# EAGLE design SSM4 (EAGLE 9.2.2)
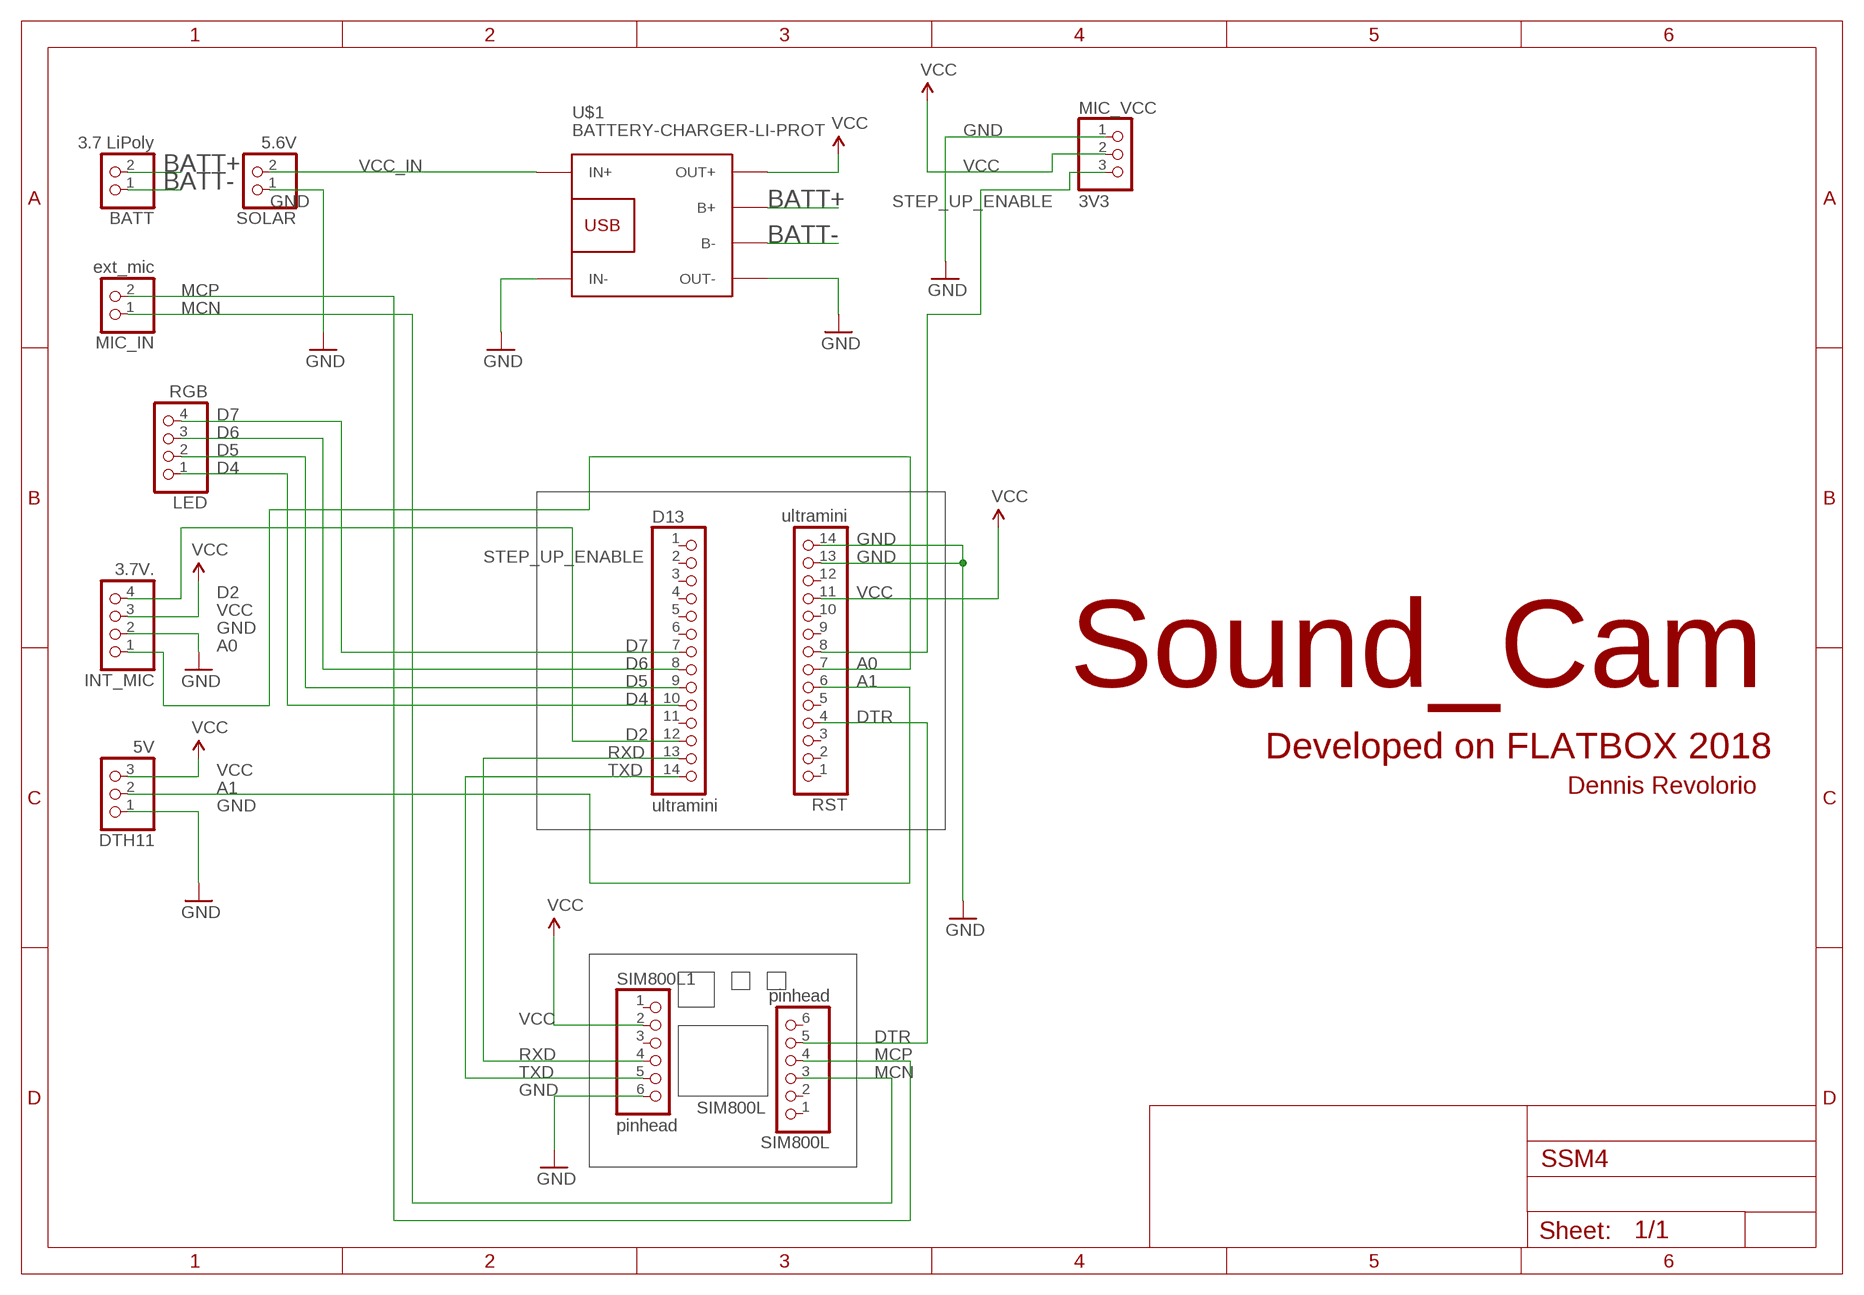
[diagram p0: schematic, sheet 1]

## Parts
BATT  3.7 LiPoly  PINHD-1X2  [1X02]
D13  ultramini  PINHD-1X14  [1X14]
DTH11  5V  PINHD-1X3  [1X03]
INT_MIC  3.7V.  PINHD-1X4  [1X04]
LED  RGB  PINHD-1X4  [1X04]
MIC_IN  ext_mic  PINHD-1X2  [1X02]
MIC_VCC  3V3  PINHD-1X3  [1X03]
RST  ultramini  PINHD-1X14  [1X14]
SIM800L  pinhead  PINHD-1X6  [1X06]
SIM800L1  pinhead  PINHD-1X6  [1X06]
SOLAR  5.6V  PINHD-1X2  [1X02]
U$1  BATTERY-CHARGER-LI-PROT  [BATTERY-CHARGER-LI-PROT]

## Nets
A0: INT_MIC.1 RST.7
A1: DTH11.2 RST.6
BATT+: BATT.2 U$1.B+
BATT-: BATT.1 U$1.B-
D2: D13.12 INT_MIC.4
D4: D13.10 LED.1
D5: D13.9 LED.2
D6: D13.8 LED.3
D7: D13.7 LED.4
DTR: RST.4 SIM800L.5
GND: DTH11.1 INT_MIC.2 MIC_VCC.1 RST.13 RST.14 SIM800L1.6 SOLAR.1 U$1.IN- U$1.OUT-
MCN: MIC_IN.1 SIM800L.3
MCP: MIC_IN.2 SIM800L.4
RXD: D13.13 SIM800L1.4
STEP_UP_ENABLE: MIC_VCC.3 RST.8
TXD: D13.14 SIM800L1.5
VCC: DTH11.3 INT_MIC.3 MIC_VCC.2 RST.11 SIM800L1.2 U$1.OUT+
VCC_IN: SOLAR.2 U$1.IN+
Unconnected: D13.1 D13.2 D13.3 D13.4 D13.5 D13.6 D13.11 RST.1 RST.2 RST.3 RST.5 RST.9 RST.10 RST.12 SIM800L1.1 SIM800L1.3 SIM800L.1 SIM800L.2 SIM800L.6

## Notes on the sheet
- Sound_Cam
- Developed on FLATBOX 2018
- Dennis Revolorio
- SIM800L

## Library data of the parts
BATT MIC_IN SOLAR = pinhead:PINHD-1X2: PIN HEADER
D13 RST = pinhead:PINHD-1X14: PIN HEADER
DTH11 MIC_VCC = pinhead:PINHD-1X3: PIN HEADER
INT_MIC LED = pinhead:PINHD-1X4: PIN HEADER
SIM800L SIM800L1 = pinhead:PINHD-1X6: PIN HEADER
U$1 = diy-modules:BATTERY-CHARGER-LI-PROT: Lithium Battery 5V Charger with protection circuit More details available here: http://www.instructables.com/id/DIY-Lithium-ion-Battery-Charger/step4/TP4056-based-lithium-ion-battery-charger-module/ Click here to find device on ebay.com <http://www.ebay.com/sch/tp4056+charger+usb+protection>

## Board
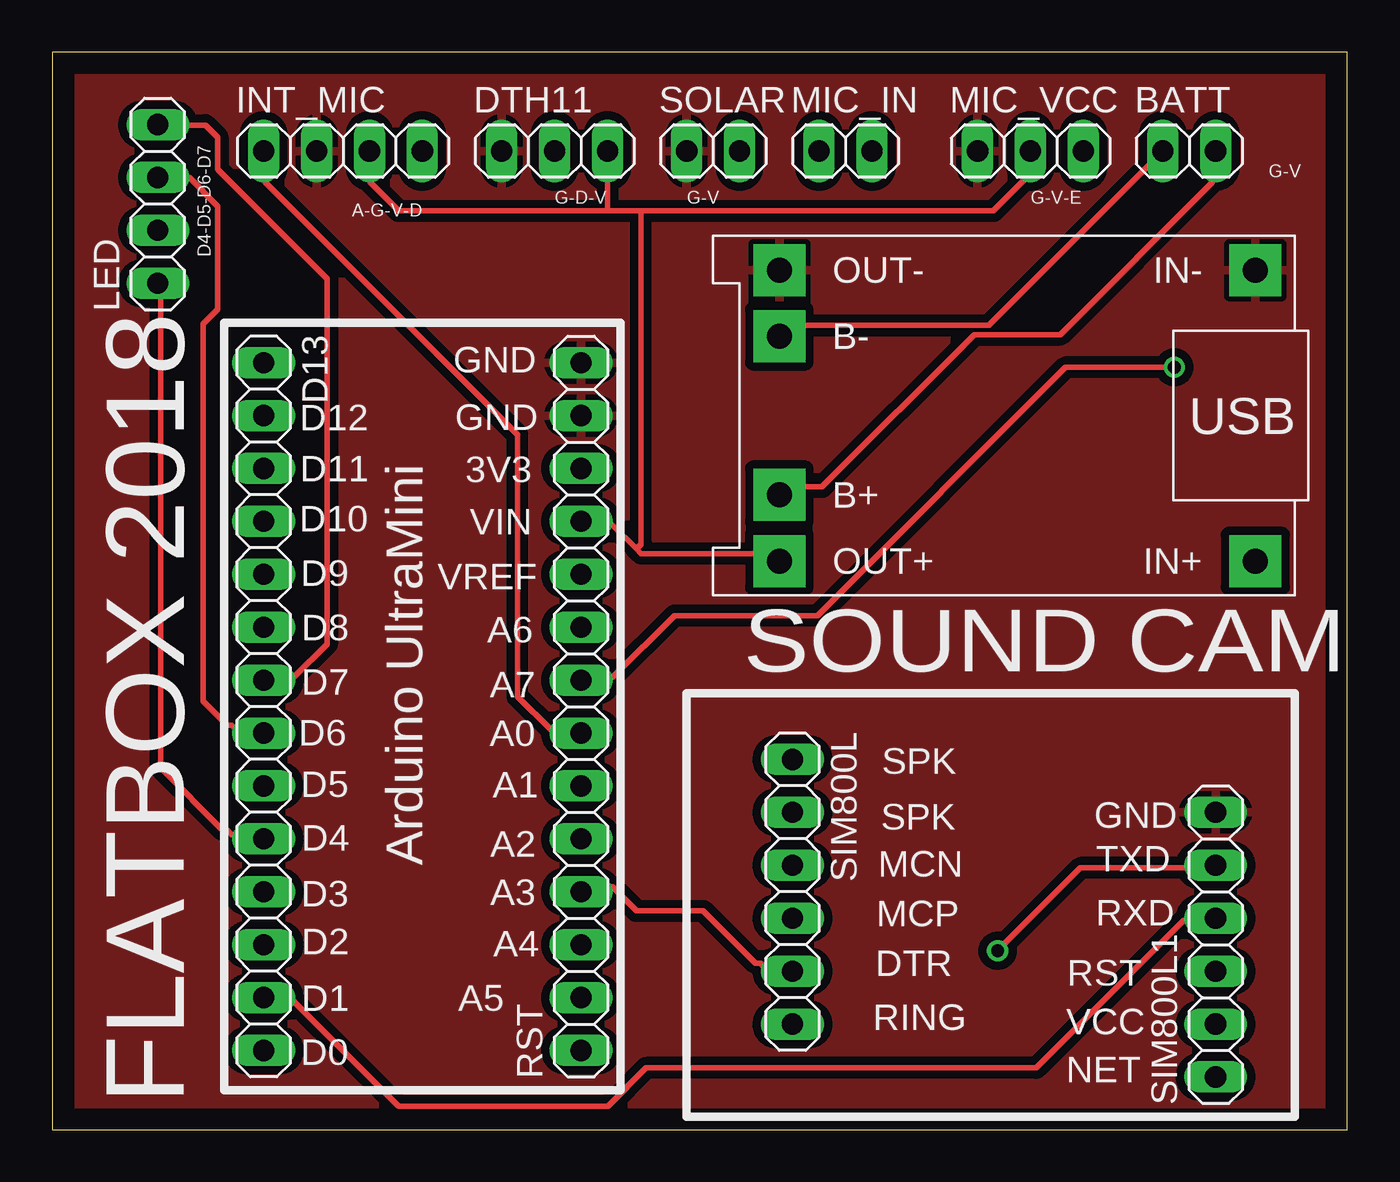
[diagram p1: board, top side]
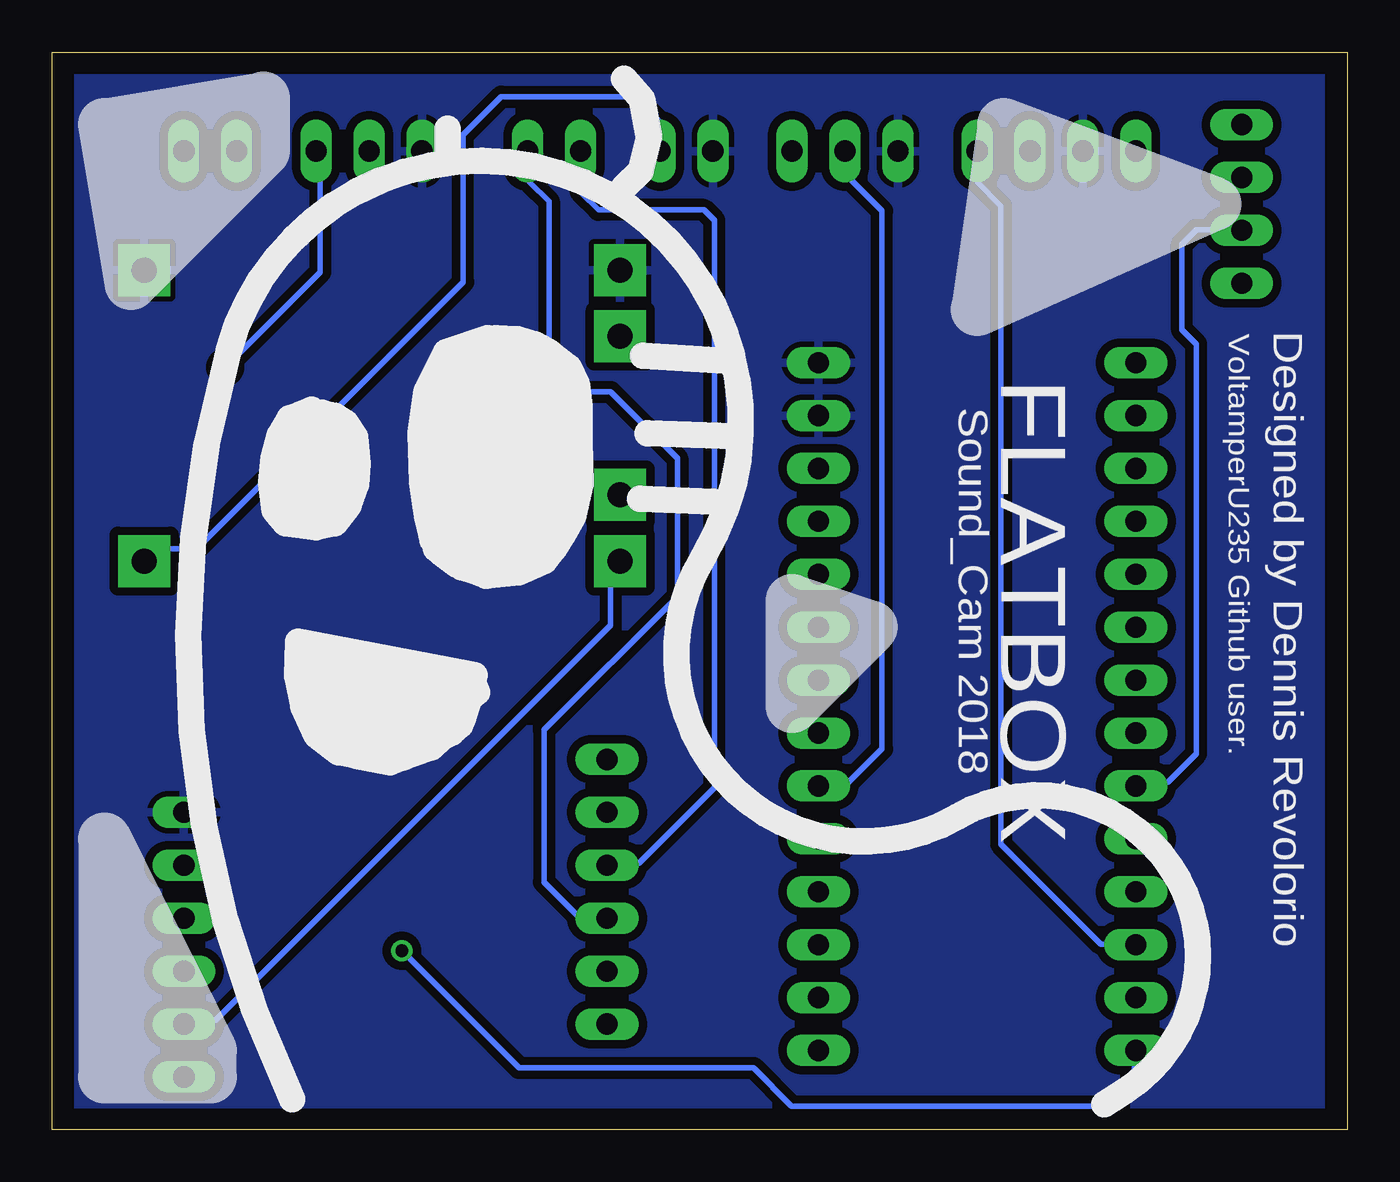
[diagram p2: board, bottom side, seen from below]

Size 62.21 x 51.74 mm. Coordinates in mm from the lower left corner, seen from the top.
Outline: 0,0 62.21,0 62.21,51.74 0,51.74 0,0
Copper layers (1*16): Top 0.035mm / dielectric 1.5mm / Bottom 0.035mm
Design rules "default": minimum track width 10mil, minimum drill 24mil, track to track 8mil, track to pad 8mil, pad to pad 8mil, via to via 8mil, smd to smd 8mil, copper to edge 40mil, drill to drill 8mil, minimum pad ring 10mil, minimum via ring 8mil, stop-mask expansion 4mil, vias tented up to drill 0mil, thermal gap 10mil

### Footprints (pad centres in the part's own frame; a part is rotated, then mirrored left to right if it is on the bottom)
1X02 = drill 1.016 long: 1 -1.27,0; 2 1.27,0
1X14 = drill 1.016 long: 1 -16.51,0; 2 -13.97,0; 3 -11.43,0; 4 -8.89,0; 5 -6.35,0; 6 -3.81,0; 7 -1.27,0; 8 1.27,0; 9 3.81,0; 10 6.35,0; 11 8.89,0; 12 11.43,0; 13 13.97,0; 14 16.51,0
1X03 = drill 1.016 long: 1 -2.54,0; 2 0,0; 3 2.54,0
1X04 = drill 1.016 long: 1 -3.81,0; 2 -1.27,0; 3 1.27,0; 4 3.81,0
1X06 = drill 1.016 long: 1 -6.35,0; 2 -3.81,0; 3 -1.27,0; 4 1.27,0; 5 3.81,0; 6 6.35,0
BATTERY-CHARGER-LI-PROT = drill 1.2 pad 2.5 square: B+ 10.795,3.81; B- 10.795,-3.81; IN+ -12.065,6.985; IN- -12.065,-6.985; OUT+ 10.795,6.985; OUT- 10.795,-6.985

### Placement (x,y rotation side)
BATT  54.61,46.99 0 top
D13  10.16,20.32 270 top
DTH11  24.13,46.99 0 top
INT_MIC  13.97,46.99 0 top
LED  5.08,44.45 90 top
MIC_IN  38.1,46.99 0 top
MIC_VCC  46.99,46.99 0 top
RST  25.4,20.32 90 top
SIM800L  35.56,11.43 270 top
SIM800L1  55.88,8.89 90 top
SOLAR  31.75,46.99 0 top
U$1  45.72,34.29 180 top

### Tracks (layer width: path | path; a pad name or v marks a point on that pad's centre or on a via)
A0
  Top 0.254: INT_MIC.1 10.24,46.86 10.24,45.49 22.35,33.38 22.35,20.8 23.95,19.2 25.32,19.2 RST.7
A1
  Bottom 0.254: DTH11.2 23.95,46.86 23.95,45.72 22.35,44.12 22.35,18.29 23.95,16.69 25.32,16.69 RST.6
BATT+
  Top 0.254: BATT.2 55.73,46.86 55.73,45.49 48.41,38.18 44.3,38.18 36.98,30.86 35.15,30.86 34.92,30.63 U$1.B+
BATT-
  Top 0.254: BATT.1 44.98,38.63 35.38,38.63 34.92,38.18 U$1.B-
D2
  Bottom 0.254: INT_MIC.4 17.78,45.49 16.64,44.35 16.64,13.72 11.84,8.91 10.24,8.91 D13.12
D4
  Top 0.254: LED.1 5.21,40.46 5.21,17.37 8.18,14.4 8.41,14.4 8.64,14.17 10.01,14.17 D13.10
D5
  Bottom 0.254: LED.2 5.21,43.2 7.26,43.2 7.95,42.52 7.95,38.41 7.26,37.72 7.26,18.06 8.64,16.69 10.01,16.69 D13.9
D6
  Top 0.254: LED.3 6.58,45.72 7.95,44.35 7.95,39.39 7.26,38.7 7.26,20.57 8.41,19.43 8.64,19.43 8.86,19.2 10.01,19.2 D13.8
D7
  Top 0.254: D13.7 10.24,21.72 11.61,21.72 13.21,23.32 13.21,40.85 7.95,46.11 7.95,47.65 7.37,48.23 5.21,48.23 LED.4
DTR
  Top 0.254: SIM800L.5 35.38,7.77 34.24,7.77 34.01,8 33.78,8 31.27,10.52 28.07,10.52 26.92,11.66 25.78,11.66 25.55,11.43 RST.4
GND
  pour Bottom (isolate 0.406): 1.27,50.8 60.96,50.8 60.96,0 1.27,0
  pour Top (isolate 0.406): 1.27,50.8 60.96,50.8 60.96,0 1.27,0
MCN
  Bottom 0.254: SIM800L.3 35.38,12.8 34.01,12.8 30.4,16.41 30.4,43.66 30.9,44.17 35.97,44.17 36.83,45.02 MIC_IN.1
MCP
  Bottom 0.254: SIM800L.4 35.61,10.29 36.98,10.29 38.58,11.89 38.58,19.2 32.18,25.6 32.18,32.23 35.38,35.43 36.75,35.43 38.35,37.03 38.35,44.58 39.27,45.49 39.27,46.86 MIC_IN.2
RXD
  Top 0.254: D13.13 10.24,6.17 11.61,6.17 16.64,1.14 26.69,1.14 28.52,2.97 47.27,2.97 54.36,10.06 55.73,10.06 SIM800L1.4
STEP_UP_ENABLE  (via drill 0.61)
  Top 0.254: v53.89,36.61 48.67,36.61 36.75,24.69 29.9,24.69 26.92,21.72 25.55,21.72 RST.8
  Bottom 0.254: v53.89,36.61 49.33,41.17 49.33,46.86 MIC_VCC.3
TXD  (via drill 0.61)
  Top 0.254: v45.41,8.59 49.39,12.57 55.73,12.57 SIM800L1.5
  Bottom 0.254: v45.41,8.59 39.79,2.97 28.52,2.97 26.69,1.14 11.38,1.14 10.24,2.29 10.24,3.66 D13.14
VCC
  Top 0.254: INT_MIC.3 15.26,46.86 15.26,45.49 16.64,44.12 26.68,44.12 | 28.3,44.12 45.21,44.12 46.81,45.72 46.81,46.86 MIC_VCC.2 | 28.07,27.89 28.3,27.66 34.7,27.66 34.92,27.43 U$1.OUT+ | 28.07,27.89 26.92,29.03 25.55,29.03 RST.11 | 28.3,44.12 28.3,28.12 28.07,27.89 | 26.68,44.12 28.3,44.12 | DTH11.3 26.67,44.13 26.68,44.12
  Bottom 0.254: SIM800L1.2 55.73,5.26 54.36,5.26 35.38,24.23 35.38,26.75 34.92,27.2 U$1.OUT+
VCC_IN
  Bottom 0.254: U$1.IN+ 57.78,27.43 57.33,27.89 55.27,27.89 42.47,40.69 42.47,47.78 40.64,49.61 34.24,49.61 33.02,48.38 SOLAR.2

### Text on the board
tPlace: G-V | A-G-V-D | G-D-V | G-V | G-V-E | D4-D5-D6-D7 | GND | D12 | GND | D11 | 3V3 | D10 | VIN | D9 | VREF | D8 | A6 | SOUND CAM | D7 | A7 | D6 | A0 | SPK | D5 | A1 | SPK | GND | D4 | Arduino UltraMini | A2 | MCN | TXD | D3 | A3 | MCP | RXD | D2 | A4 | DTR | RST | D1 | A5 | RING | VCC | D0 | NET | FLATBOX 2018
bPlace: Designed by Dennis Revolorio | VoltamperU235 Github user. | FLATBOX | Sound_Cam 2018